# Altium schematic sheet 03a_POWER-DISCRETE.SchDoc
size A2
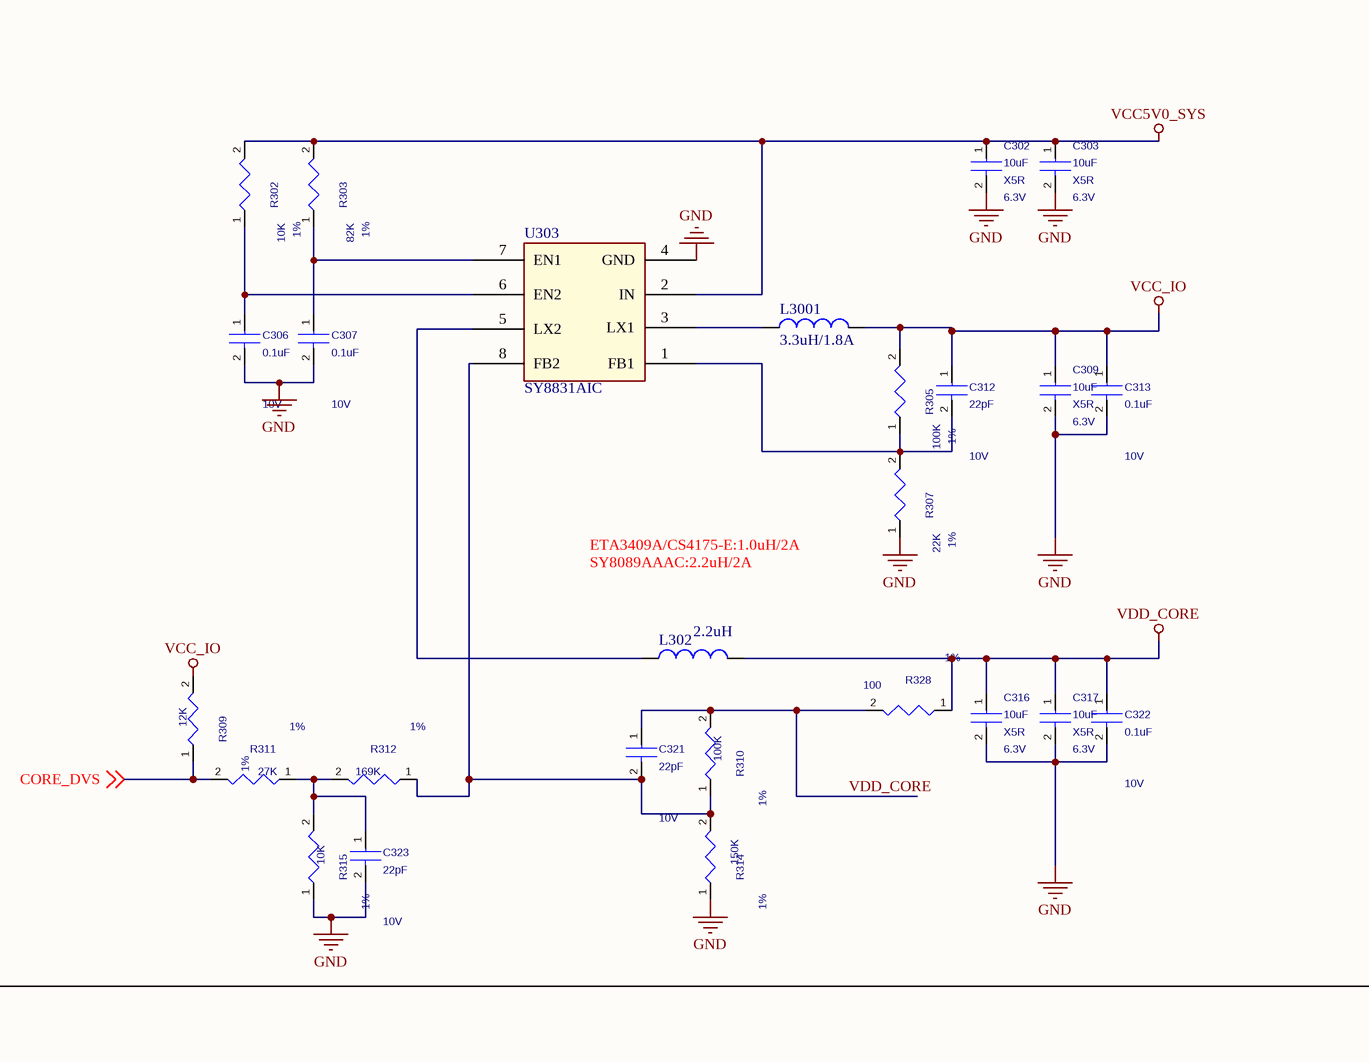
[diagram p0: 03a_POWER-DISCRETE.SchDoc, top left]
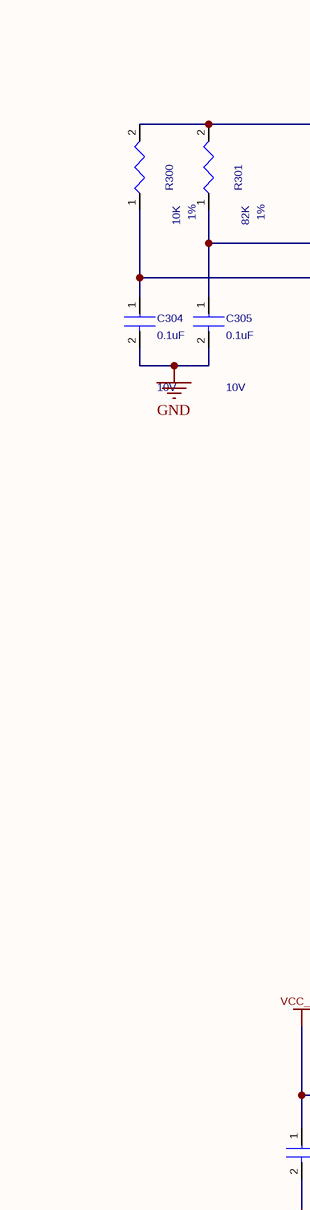
[diagram p1: 03a_POWER-DISCRETE.SchDoc, top middle]
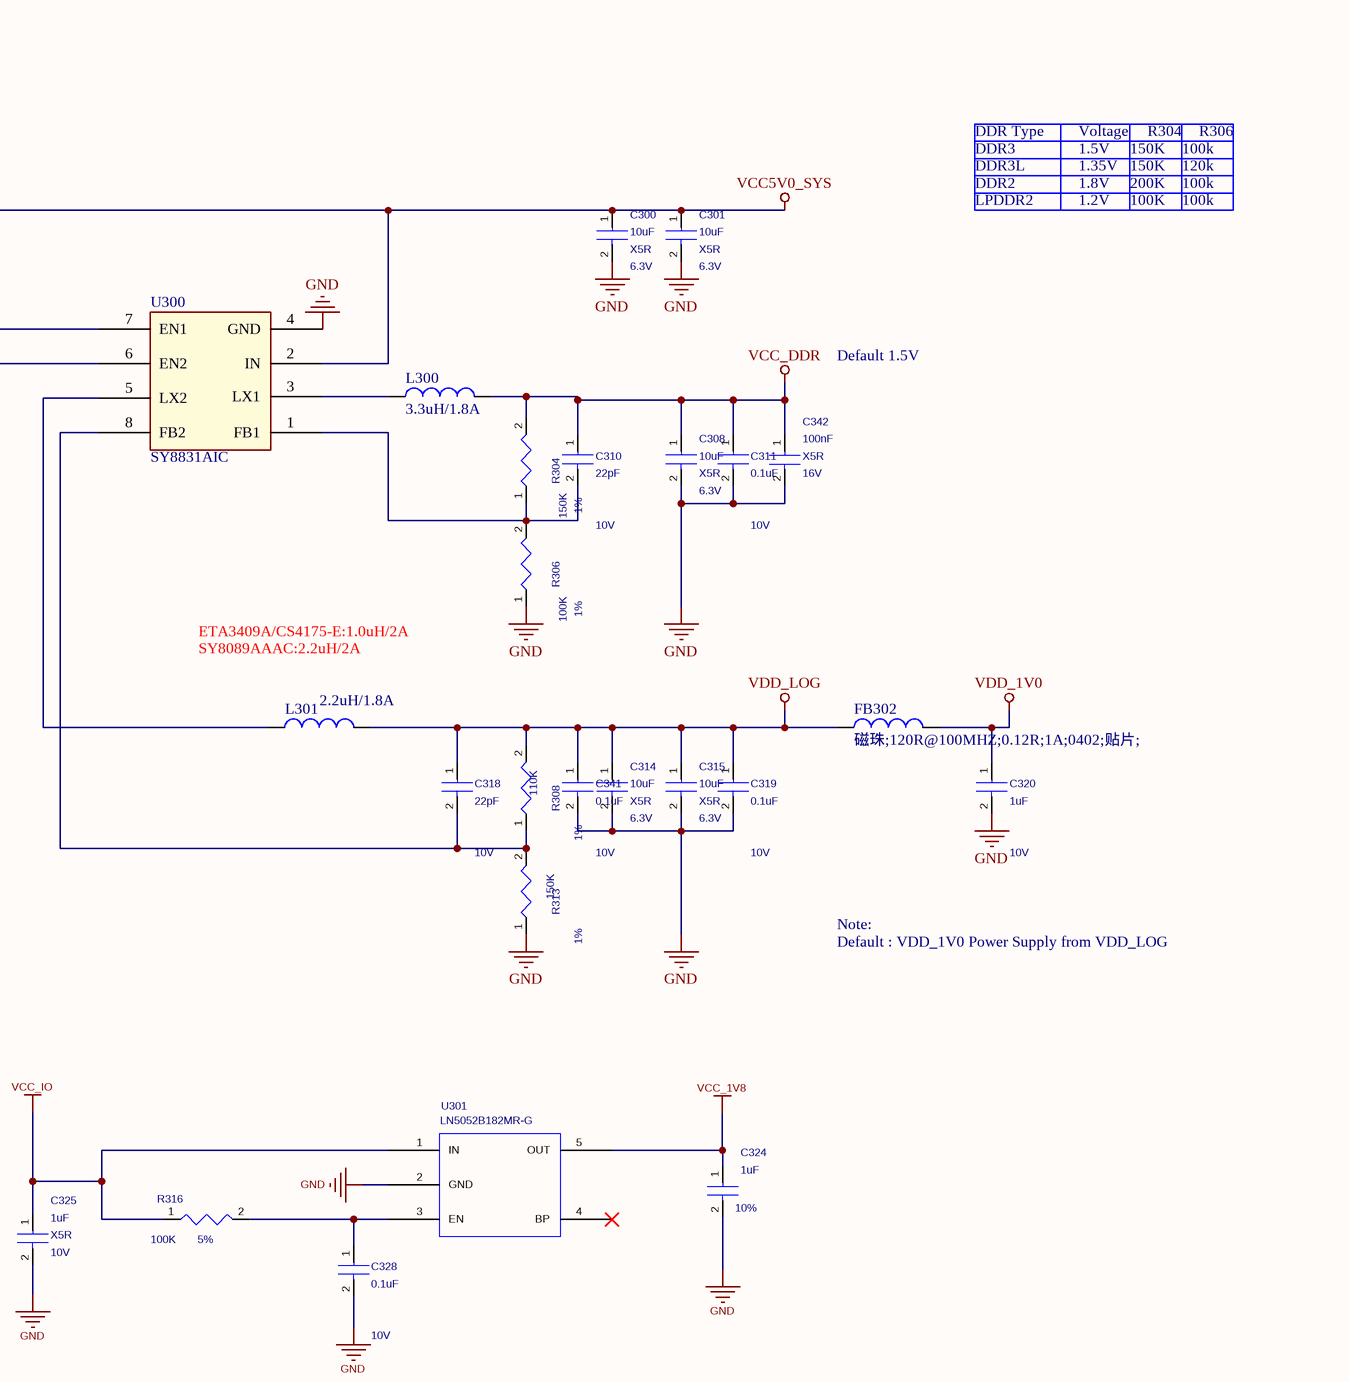
[diagram p2: 03a_POWER-DISCRETE.SchDoc, top right]
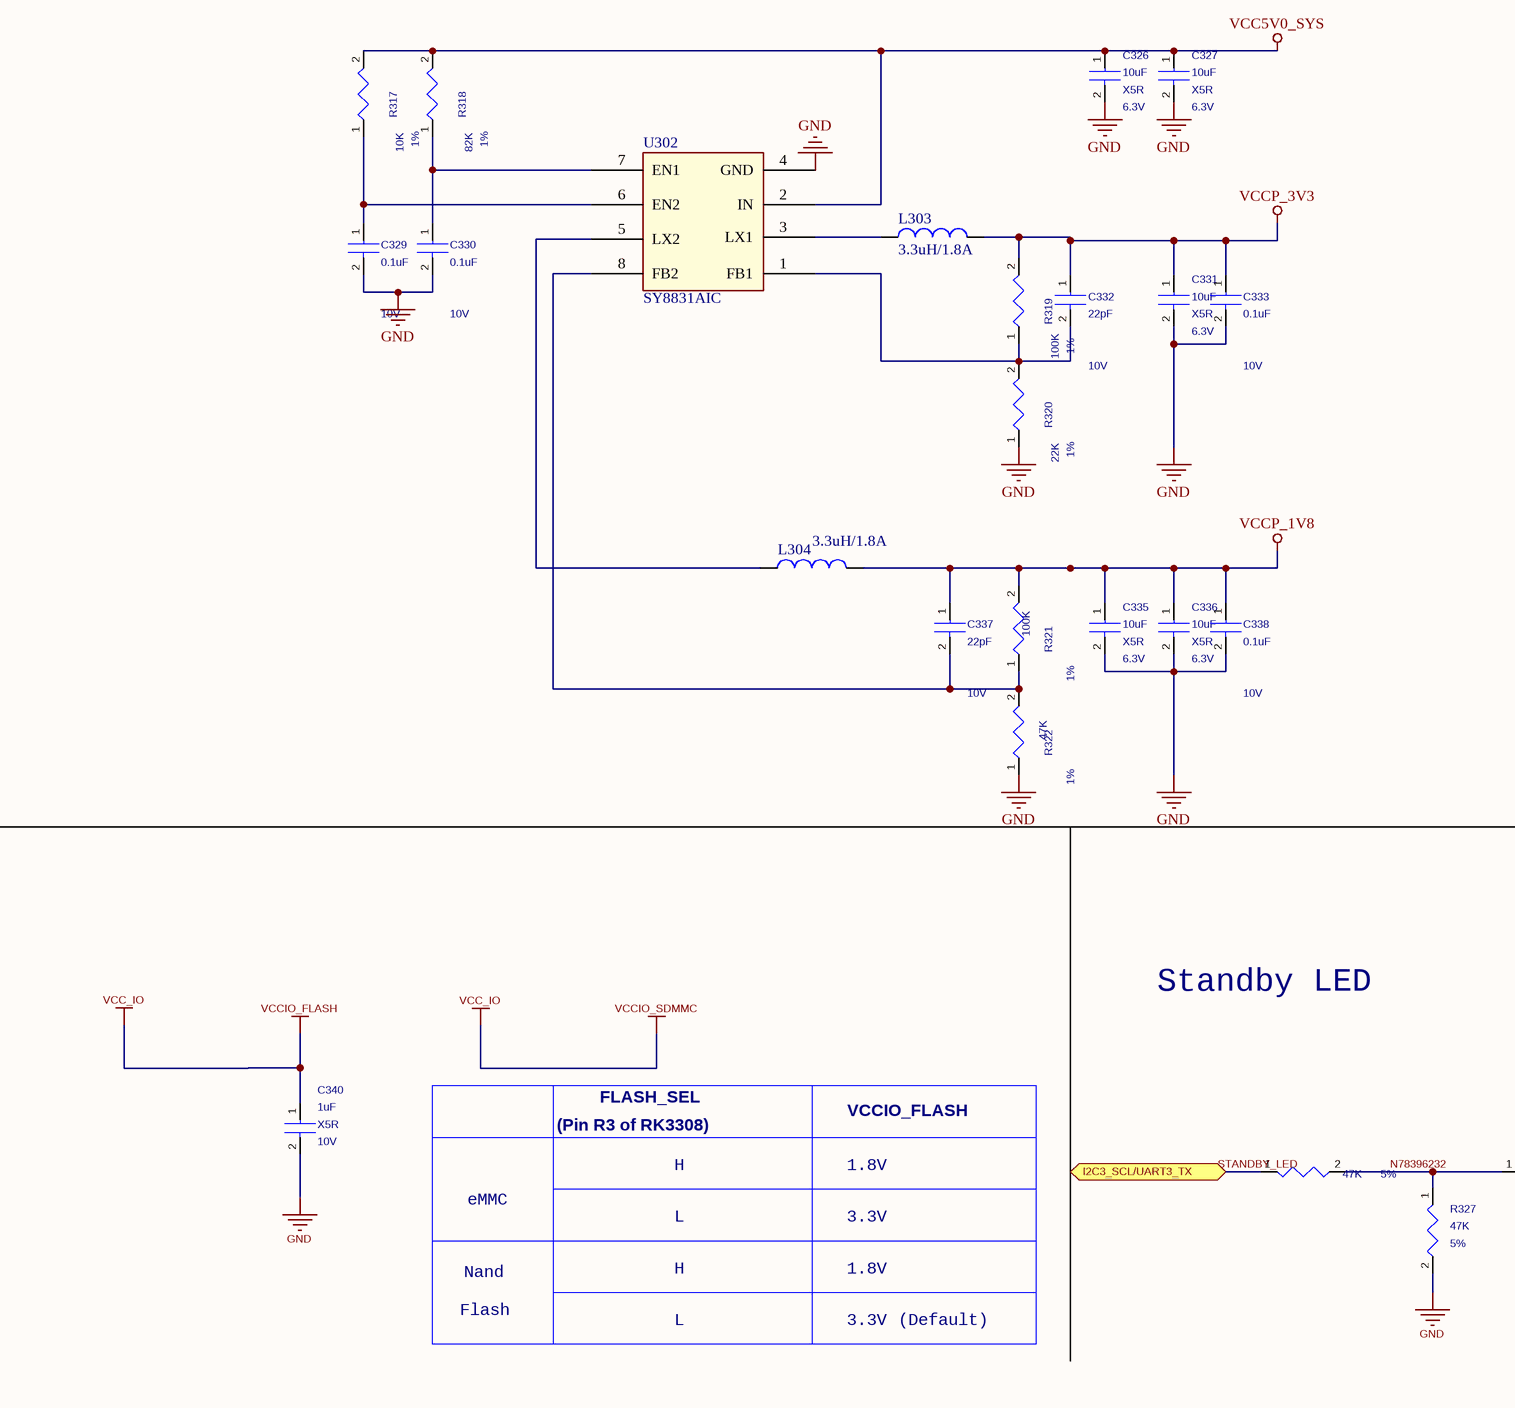
[diagram p3: 03a_POWER-DISCRETE.SchDoc, bottom left]
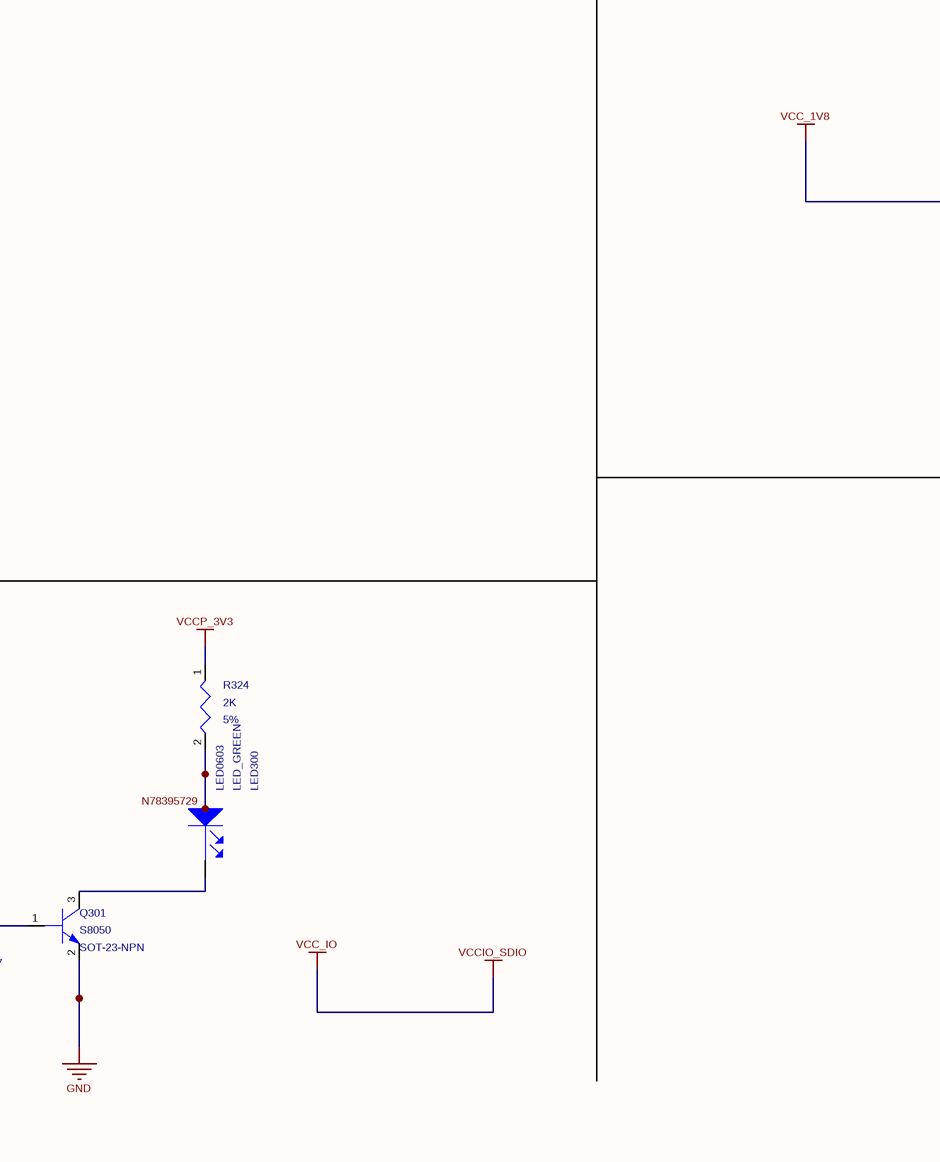
[diagram p4: 03a_POWER-DISCRETE.SchDoc, bottom middle]
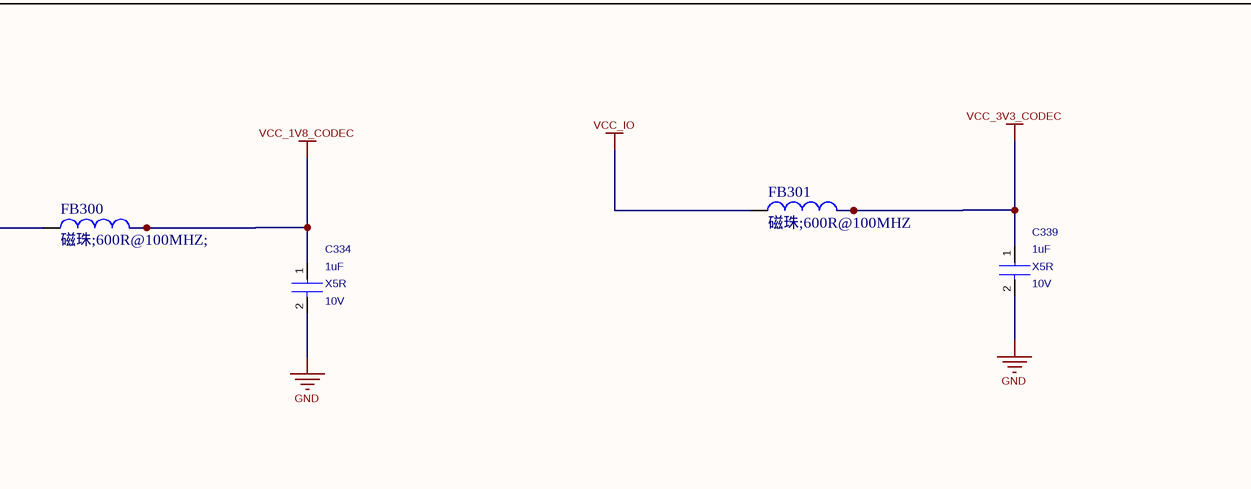
[diagram p5: 03a_POWER-DISCRETE.SchDoc, bottom right]

## Parts
C300  value 10uF  Dielectric: X5R  Voltage: 6.3V  [C0603]  (hidden comment: CAP_NP_2)
C301  value 10uF  Dielectric: X5R  Voltage: 6.3V  [C0603]  (hidden comment: CAP_NP_2)
C302  value 10uF  Dielectric: X5R  Voltage: 6.3V  [C0603]  (hidden comment: CAP_NP_2)
C303  value 10uF  Dielectric: X5R  Voltage: 6.3V  [C0603]  (hidden comment: CAP_NP_2)
C304  value 0.1uF  Voltage: 10V  [C0402]  (hidden comment: CAP_NP_2)
C305  value 0.1uF  Voltage: 10V  [C0402]  (hidden comment: CAP_NP_2)
C306  value 0.1uF  Voltage: 10V  [C0402]  (hidden comment: CAP_NP_2)
C307  value 0.1uF  Voltage: 10V  [C0402]  (hidden comment: CAP_NP_2)
C308  value 10uF  Dielectric: X5R  Voltage: 6.3V  [C0603]  (hidden comment: CAP_NP_2)
C309  value 10uF  Dielectric: X5R  Voltage: 6.3V  [C0603]  (hidden comment: CAP_NP_2)
C310  value 22pF  Voltage: 10V  [C0402]  (hidden comment: CAP_NP_2)
C311  value 0.1uF  Voltage: 10V  [C0402]  (hidden comment: CAP_NP_2)
C312  value 22pF  Voltage: 10V  [C0402]  (hidden comment: CAP_NP_2)
C313  value 0.1uF  Voltage: 10V  [C0402]  (hidden comment: CAP_NP_2)
C314  value 10uF  Dielectric: X5R  Voltage: 6.3V  [C0603]  (hidden comment: CAP_NP_2)
C315  value 10uF  Dielectric: X5R  Voltage: 6.3V  [C0603]  (hidden comment: CAP_NP_2)
C316  value 10uF  Dielectric: X5R  Voltage: 6.3V  [C0603]  (hidden comment: CAP_NP_2)
C317  value 10uF  Dielectric: X5R  Voltage: 6.3V  [C0603]  (hidden comment: CAP_NP_2)
C318  value 22pF  Voltage: 10V  [C0402]  (hidden comment: CAP_NP_2)
C319  value 0.1uF  Voltage: 10V  [C0402]  (hidden comment: CAP_NP_2)
C320  value 1uF  Voltage: 10V  [C0402]  (hidden comment: CAP_NP_2)
C321  value 22pF  Voltage: 10V  [C0402]  (hidden comment: CAP_NP_2)
C322  value 0.1uF  Voltage: 10V  [C0402]  (hidden comment: CAP_NP_2)
C323  value 22pF  Voltage: 10V  [C0402]  (hidden comment: CAP_NP_2)
C324  value 1uF  Tolerance: 10%  [C0402]  (hidden comment: CAP_NP_2)
C325  value 1uF  Voltage: 10V  Dielectric: X5R  [C0402]  (hidden comment: CAP_NP_2)
C326  value 10uF  Dielectric: X5R  Voltage: 6.3V  [C0603]  (hidden comment: CAP_NP_2)
C327  value 10uF  Dielectric: X5R  Voltage: 6.3V  [C0603]  (hidden comment: CAP_NP_2)
C328  value 0.1uF  Voltage: 10V  [C0402]  (hidden comment: CAP_NP_2)
C329  value 0.1uF  Voltage: 10V  [C0402]  (hidden comment: CAP_NP_2)
C330  value 0.1uF  Voltage: 10V  [C0402]  (hidden comment: CAP_NP_2)
C331  value 10uF  Dielectric: X5R  Voltage: 6.3V  [C0603]  (hidden comment: CAP_NP_2)
C332  value 22pF  Voltage: 10V  [C0402]  (hidden comment: CAP_NP_2)
C333  value 0.1uF  Voltage: 10V  [C0402]  (hidden comment: CAP_NP_2)
C334  value 1uF  Voltage: 10V  Dielectric: X5R  [C0402]  (hidden comment: CAP_NP_2)
C335  value 10uF  Dielectric: X5R  Voltage: 6.3V  [C0603]  (hidden comment: CAP_NP_2)
C336  value 10uF  Dielectric: X5R  Voltage: 6.3V  [C0603]  (hidden comment: CAP_NP_2)
C337  value 22pF  Voltage: 10V  [C0402]  (hidden comment: CAP_NP_2)
C338  value 0.1uF  Voltage: 10V  [C0402]  (hidden comment: CAP_NP_2)
C339  value 1uF  Voltage: 10V  Dielectric: X5R  [C0402]  (hidden comment: CAP_NP_2)
C340  value 1uF  Voltage: 10V  Dielectric: X5R  [C0402]  (hidden comment: CAP_NP_2)
C341  value 0.1uF  Voltage: 10V  [C0402]  (hidden comment: CAP_NP_2)
C342  value 100nF  Voltage: 16V  Dielectric: X5R  [C0402]  (hidden comment: CAP_NP_2)
FB300  磁珠;600R@100MHZ;  [L0402]
FB301  磁珠;600R@100MHZ  [L0402]
FB302  磁珠;120R@100MHZ;0.12R;1A;0402;贴片;  [L0402]
L300  3.3uH/1.8A  [IND2520]
L301  2.2uH/1.8A  [IND2520]
L302  2.2uH  [IND2520]
L303  3.3uH/1.8A  [IND2520]
L304  3.3uH/1.8A  [IND2520]
L3001  3.3uH/1.8A  [IND2520]
LED300  value LED_GREEN  [LED0603]  (hidden comment: LED)
Q301  value S8050  PCB DECAL: SOT-23-NPN  [SOT23]  (hidden comment: NPN)
R300  value 10K  Tolerance: 1%  [R0402]  (hidden comment: RESISTOR)
R301  value 82K  Tolerance: 1%  [R0402]  (hidden comment: RESISTOR)
R302  value 10K  Tolerance: 1%  [R0402]  (hidden comment: RESISTOR)
R303  value 82K  Tolerance: 1%  [R0402]  (hidden comment: RESISTOR)
R304  value 150K  Tolerance: 1%  [R0402]  (hidden comment: RESISTOR)
R305  value 100K  Tolerance: 1%  [R0402]  (hidden comment: RESISTOR)
R306  value 100K  Tolerance: 1%  [R0402]  (hidden comment: RESISTOR)
R307  value 22K  Tolerance: 1%  [R0402]  (hidden comment: RESISTOR)
R308  value 110K  Tolerance: 1%  [R0402]  (hidden comment: RESISTOR)
R309  value 12K  Tolerance: 1%  [R0402]  (hidden comment: RESISTOR)
R310  value 100K  Tolerance: 1%  [R0402]  (hidden comment: RESISTOR)
R311  value 27K  Tolerance: 1%  [R0402]  (hidden comment: RESISTOR)
R312  value 169K  Tolerance: 1%  [R0402]  (hidden comment: RESISTOR)
R313  value 150K  Tolerance: 1%  [R0402]  (hidden comment: RESISTOR)
R314  value 150K  Tolerance: 1%  [R0402]  (hidden comment: RESISTOR)
R315  value 10K  Tolerance: 1%  [R0402]  (hidden comment: RESISTOR)
R316  value 100K  Tolerance: 5%  [R0402]  (hidden comment: RESISTOR)
R317  value 10K  Tolerance: 1%  [R0402]  (hidden comment: RESISTOR)
R318  value 82K  Tolerance: 1%  [R0402]  (hidden comment: RESISTOR)
R319  value 100K  Tolerance: 1%  [R0402]  (hidden comment: RESISTOR)
R320  value 22K  Tolerance: 1%  [R0402]  (hidden comment: RESISTOR)
R321  value 100K  Tolerance: 1%  [R0402]  (hidden comment: RESISTOR)
R322  value 47K  Tolerance: 1%  [R0402]  (hidden comment: RESISTOR)
R324  value 2K  Tolerance: 5%  [R0402]  (hidden comment: RESISTOR)
R326  value 47K  Tolerance: 5%  [R0402]  (hidden comment: RESISTOR)
R327  value 47K  Tolerance: 5%  [R0402]  (hidden comment: RESISTOR)
R328  value 100  Tolerance: 1%  [R0402]  (hidden comment: RESISTOR)
U300  SY8831AIC  [TSOT23-8]
U301  LN5052B182MR-G  [SOT_23_5]
U302  SY8831AIC  [TSOT23-8]
U303  SY8831AIC  [TSOT23-8]

## Ports
I2C3_SCL/UART3_TX (bidir)

## Nets
GND: C300.2 C301.2 C302.2 C303.2 C304.2 C305.2 C306.2 C307.2 C308.2 C309.2 C311.2 C313.2 C314.2 C315.2 C316.2 C317.2 C319.2 C320.2 C322.2 C323.2 C324.2 C325.2 C326.2 C327.2 C328.2 C329.2 C330.2 C331.2 C333.2 C334.2 C335.2 C336.2 C338.2 C339.2 C340.2 C341.2 C342.2 Q301.2(EMITTER) R306.1 R307.1 R313.1 R314.1 R315.1 R320.1 R322.1 R327.2 U300.4(GND) U301.2(GND) U302.4(GND) U303.4(GND)
VCC5V0_SYS: C300.1 C301.1 C302.1 C303.1 C326.1 C327.1 R300.2 R301.2 R302.2 R303.2 R317.2 R318.2 U300.2(IN) U302.2(IN) U303.2(IN)
VCC_1V8: C324.1 FB300.1 U301.5(OUT)
VCC_1V8_CODEC: C334.1 FB300.2
VCC_3V3_CODEC: C339.1 FB301.2
VCC_DDR: C308.1 C310.1 C311.1 C342.1 L300.2 R304.2
VCC_IO: C309.1 C312.1 C313.1 C325.1 C340.1 FB301.1 L3001.2 R305.2 R309.2 R316.1 U301.1(IN)  [also labelled VCCIO_FLASH, VCCIO_SDIO, VCCIO_SDMMC]
VCCP_1V8: C335.1 C336.1 C337.1 C338.1 L304.2 R321.2
VCCP_3V3: C331.1 C332.1 C333.1 L303.2 R319.2 R324.1
VDD_1V0: C320.1 FB302.2
VDD_CORE: C316.1 C317.1 C321.1 C322.1 L302.2 R310.2 R328.1 R328.2
VDD_LOG: C314.1 C315.1 C318.1 C319.1 C341.1 FB302.1 L301.2 R308.2
CORE_DVS: R309.1 R311.2 ; off-sheet CORE_DVS
I2C3_SCL/UART3_TX: R326.1 ; port I2C3_SCL/UART3_TX
N78396232: Q301.1(BASE) R326.2 R327.1
NetC304_1: C304.1 R300.1 U300.6(EN2)
NetC305_1: C305.1 R301.1 U300.7(EN1)
NetC306_1: C306.1 R302.1 U303.6(EN2)
NetC307_1: C307.1 R303.1 U303.7(EN1)
NetC310_2: C310.2 R304.1 R306.2 U300.1(FB1)
NetC312_2: C312.2 R305.1 R307.2 U303.1(FB1)
NetC318_2: C318.2 R308.1 R313.2 U300.8(FB2)
NetC321_2: C321.2 R310.1 R312.1 R314.2 U303.8(FB2)
NetC323_1: C323.1 R311.1 R312.2 R315.2
NetC328_1: C328.1 R316.2 U301.3(EN)
NetC329_1: C329.1 R317.1 U302.6(EN2)
NetC330_1: C330.1 R318.1 U302.7(EN1)
NetC332_2: C332.2 R319.1 R320.2 U302.1(FB1)
NetC337_2: C337.2 R321.1 R322.2 U302.8(FB2)
NetL300_1: L300.1 U300.3(LX1)
NetL301_1: L301.1 U300.5(LX2)
NetL302_1: L302.1 U303.5(LX2)
NetL303_1: L303.1 U302.3(LX1)
NetL304_1: L304.1 U302.5(LX2)
NetL3001_1: L3001.1 U303.3(LX1)
NetLED300_1: LED300.1(ANODE) R324.2
NetLED300_2: LED300.2(CATHODE) Q301.3(COLLECTOR)

Not connected (* = marked no-connect by the designer): U301 4(BP)*

## Notes on the sheet
- DDR Type
- DDR3
- DDR3L
- DDR2
- LPDDR2
- Voltage
- 1.5V
- 1.35V
- 1.8V
- 1.2V
- 150K
- 200K
- 100K
- R304
- 100k
- 120k
- R306
- Default 1.5V
- ETA3409A/CS4175-E:1.0uH/2A
- SY8089AAAC:2.2uH/2A
- Note:
- Default : VDD_1V0 Power Supply from VDD_LOG
- Standby LED
- FLASH_SEL
- (Pin R3 of RK3308)
- H
- VCCIO_FLASH
- Nand
- eMMC
- L
- 3.3V
- Flash
- (Default)
- Labels drawn without touching a wire or pin: N78395729, STANDBY_LED
- Title
- Size:
- Date:
- File:
- A2
- Number:
- Time:
- Revision:
- Sheet
- of

## Library data of the parts
C300-C303 C308 C309 C314-C317 C326 C327 C331 C335 C336 = CAP_NP_2: cap,10.00uF,+/-10%,6.3V,X5R,C0603; Manufacturer: TDK; RK_PN: C1608X5R0J106K080AB; Priority: A; Tolerance: 10%; Created_by: JJJ; Source_Path: Z:\RK_STANDARD_LIBRARY\CADENCE_CIS\RK_DISCRETE.OLB; Number: 1; PCB DECAL: C0603; Part_Type: C0603; Manufacturer_PN: C1608X5R0J106K080AB
C304-C307 C311 C313 C319 C322 C328-C330 C333 C338 C341 = CAP_NP_2: cap,0.1uF,+/-10%,10V,X5R,C0402; Manufacturer: TDK; RK_PN: C1005X5R1A105K050BB; Priority: A; C_Voltage: 6.3V; Tolerance: 10%; Created_by: JJJ; Source_Path: Z:\RK_STANDARD_LIBRARY\CADENCE_CIS\RK_DISCRETE.OLB; Part_Type: C0402; Dielectric: X5R; Manufacturer_PN: C1005X5R1A105K050BB; PCB DECAL: C0402
C310 C312 C318 C321 C323 C332 C337 = CAP_NP_2: cap,22pF,+/-10%,10V,X5R,C0402; Manufacturer: TDK; RK_PN: C1005X5R1A105K050BB; Priority: A; C_Voltage: 6.3V; Tolerance: 10%; Created_by: JJJ; Source_Path: Z:\RK_STANDARD_LIBRARY\CADENCE_CIS\RK_DISCRETE.OLB; Part_Type: C0402; Dielectric: X5R; Manufacturer_PN: C1005X5R1A105K050BB; PCB DECAL: C0402
C320 = CAP_NP_2: cap,1uF,+/-10%,10V,X5R,C0402; Manufacturer: TDK; RK_PN: C1005X5R1A105K050BB; Priority: A; C_Voltage: 6.3V; Tolerance: 10%; Created_by: JJJ; Source_Path: Z:\RK_STANDARD_LIBRARY\CADENCE_CIS\RK_DISCRETE.OLB; Part_Type: C0402; Dielectric: X5R; Manufacturer_PN: C1005X5R1A105K050BB; PCB DECAL: C0402
C324 = CAP_NP_2: cap,1.00uF,+/-10%,10V,X5R,C0402; Manufacturer_PN: C1005X5R1A105K050BB; Manufacturer: TDK; Created_by: JJJ; C_Voltage: 6.3V; Priority: A; Source_Path: Z:\RK_STANDARD_LIBRARY\CADENCE_CIS\RK_DISCRETE.OLB; PCB DECAL: C0402; Voltage: 10V; Dielectric: X5R; Part_Type: C0402; RK_PN: C1005X5R1A105K050BB
C325 = CAP_NP_2: cap,1.00uF,+/-10%,10V,X5R,C0402; Manufacturer: TDK; RK_PN: C1005X5R1A105K050BB; Priority: A; C_Voltage: 6.3V; Tolerance: 10%; Created_by: JJJ; Source_Path: Z:\RK_STANDARD_LIBRARY\CADENCE_CIS\RK_DISCRETE.OLB; PCB DECAL: C0402; Part_Type: C0402; Manufacturer_PN: C1005X5R1A105K050BB
C334 C339 C340 = CAP_NP_2: cap,1.00uF,+/-10%,10V,X5R,C0402; Manufacturer_PN: C1005X5R1A105K050BB; Manufacturer: TDK; Created_by: JJJ; Tolerance: 10%; C_Voltage: 6.3V; Priority: A; Source_Path: Z:\RK_STANDARD_LIBRARY\CADENCE_CIS\RK_DISCRETE.OLB; PCB DECAL: C0402; Part_Type: C0402; RK_PN: C1005X5R1A105K050BB
C342 = CAP_NP_2: cap,100.00nF,+/-10%,16V,X5R,C0402; Manufacturer: TDK; Number: 1; RK_PN: C1005X5R1C104K050BA; Priority: A; Tolerance: 10%; Created_by: JJJ; Source_Path: Z:\RK_STANDARD_LIBRARY\CADENCE_CIS\RK_DISCRETE.OLB; PCB DECAL: C0402; Part_Type: C0402; Manufacturer_PN: C1005X5R1C104K050BA
FB300 = INDUCTOR: GZ0603D601TF
FB301 = INDUCTOR: L0603-0欧姆-1A
FB302 = INDUCTOR: PZ1005U121-1R0T
L300 L303 L304 L3001 = INDUCTOR: SWPA252012S3R3MT
L301 L302 = INDUCTOR: SPH252012H2R2MT
LED300 = LED: 贴片LED灯，0603，绿色; Created_by: JJJ; Priority: A; Source_Path: Z:\RK_STANDARD_LIBRARY\CADENCE_CIS\RK_DISCRETE.OLB; PCB DECAL: LED0603; Part_Type: LED; RK_PN: LED_GREEN
Q301 = NPN: S8050,SOT23; Manufacturer_PN: S8050_SOT23; Manufacturer: 长电; Created_by: JJJ; Pc: 0.3W; Vceo: 25V; Ic: 0.5A; Priority: A; Source_Path: Z:\RK_STANDARD_LIBRARY\CADENCE_CIS\RK_DISCRETE.OLB; Number: 1; Geometry.Height: 1.100mm; Part_Type: NPN; RK_PN: S8050
R300 R302 R315 R317 = RESISTOR: ?用厚膜电阻,10K,+/-1%,R0402,1/16W.; Manufacturer_PN: RC0402FR-0727KL; Manufacturer: YAGEO; Created_by: YTL; Wattage: 1/16W; Priority: A; Source_Path: Z:\RK_STANDARD_LIBRARY\CADENCE_CIS\RK_DISCRETE.OLB; PCB DECAL: R0402; Part_Type: ?用厚膜电阻; RK_PN: RC0402FR-0727KL
R301 R303 R318 = RESISTOR: ?用厚膜电阻,82K,+/-1%,R0402,1/16W.; Manufacturer_PN: RC0402FR-0727KL; Manufacturer: YAGEO; Created_by: YTL; Wattage: 1/16W; Priority: A; Source_Path: Z:\RK_STANDARD_LIBRARY\CADENCE_CIS\RK_DISCRETE.OLB; PCB DECAL: R0402; Part_Type: ?用厚膜电阻; RK_PN: RC0402FR-0727KL
R304 R313 R314 = RESISTOR: ?用厚膜电阻,150K,+/-1%,R0402,1/16W.; Manufacturer_PN: RC0402FR-0727KL; Manufacturer: YAGEO; Created_by: YTL; Wattage: 1/16W; Priority: A; Source_Path: Z:\RK_STANDARD_LIBRARY\CADENCE_CIS\RK_DISCRETE.OLB; PCB DECAL: R0402; Part_Type: ?用厚膜电阻; RK_PN: RC0402FR-0727KL
R305 R306 R310 R319 R321 = RESISTOR: ?用厚膜电阻,100K,+/-1%,R0402,1/16W.; Manufacturer_PN: RC0402FR-0727KL; Manufacturer: YAGEO; Created_by: YTL; Wattage: 1/16W; Priority: A; Source_Path: Z:\RK_STANDARD_LIBRARY\CADENCE_CIS\RK_DISCRETE.OLB; PCB DECAL: R0402; Part_Type: ?用厚膜电阻; RK_PN: RC0402FR-0727KL
R307 R320 = RESISTOR: ?用厚膜电阻,22K,+/-1%,R0402,1/16W.; Manufacturer_PN: RC0402FR-0727KL; Manufacturer: YAGEO; Created_by: YTL; Wattage: 1/16W; Priority: A; Source_Path: Z:\RK_STANDARD_LIBRARY\CADENCE_CIS\RK_DISCRETE.OLB; PCB DECAL: R0402; Part_Type: ?用厚膜电阻; RK_PN: RC0402FR-0727KL
R308 = RESISTOR: ?用厚膜电阻,110K,+/-1%,R0402,1/16W.; Manufacturer_PN: RC0402FR-0727KL; Manufacturer: YAGEO; Created_by: YTL; Wattage: 1/16W; Priority: A; Source_Path: Z:\RK_STANDARD_LIBRARY\CADENCE_CIS\RK_DISCRETE.OLB; PCB DECAL: R0402; Part_Type: ?用厚膜电阻; RK_PN: RC0402FR-0727KL
R309 = RESISTOR: ?用厚膜电阻,12K,+/-1%,R0402,1/16W.; Manufacturer_PN: RC0402FR-0727KL; Manufacturer: YAGEO; Created_by: YTL; Wattage: 1/16W; Priority: A; Source_Path: Z:\RK_STANDARD_LIBRARY\CADENCE_CIS\RK_DISCRETE.OLB; PCB DECAL: R0402; Part_Type: ?用厚膜电阻; RK_PN: RC0402FR-0727KL
R311 = RESISTOR: ?用厚膜电阻,27K,+/-1%,R0402,1/16W.; Manufacturer_PN: RC0402FR-0727KL; Manufacturer: YAGEO; Created_by: YTL; Wattage: 1/16W; Priority: A; Source_Path: Z:\RK_STANDARD_LIBRARY\CADENCE_CIS\RK_DISCRETE.OLB; PCB DECAL: R0402; Part_Type: ?用厚膜电阻; RK_PN: RC0402FR-0727KL
R312 = RESISTOR: ?用厚膜电阻,169K,+/-1%,R0402,1/16W.; Manufacturer_PN: RC0402FR-0727KL; Manufacturer: YAGEO; Created_by: YTL; Wattage: 1/16W; Priority: A; Source_Path: Z:\RK_STANDARD_LIBRARY\CADENCE_CIS\RK_DISCRETE.OLB; PCB DECAL: R0402; Part_Type: ?用厚膜电阻; RK_PN: RC0402FR-0727KL
R316 = RESISTOR: ?用厚膜电阻,100K,+/-5%,R0402,1/16W.; Manufacturer: YAGEO; RK_PN: RC0402JR-07100KL; Priority: A; Wattage: 1/16W; Created_by: YTL; Source_Path: Z:\RK_STANDARD_LIBRARY\CADENCE_CIS\RK_DISCRETE.OLB; Number: 1; PCB DECAL: R0402; Part_Type: ?用厚膜电阻; Manufacturer_PN: RC0402JR-07100KL
R322 = RESISTOR: ?用厚膜电阻,47K,+/-1%,R0402,1/16W.; Manufacturer_PN: RC0402FR-0727KL; Manufacturer: YAGEO; Created_by: YTL; Wattage: 1/16W; Priority: A; Source_Path: Z:\RK_STANDARD_LIBRARY\CADENCE_CIS\RK_DISCRETE.OLB; PCB DECAL: R0402; Part_Type: ?用厚膜电阻; RK_PN: RC0402FR-0727KL
R324 = RESISTOR: ?用厚膜电阻,2K,+/-5%,R0402,1/16W.; Manufacturer: YAGEO; RK_PN: RC0402JR-072KL; Priority: A; Wattage: 1/16W; Created_by: YTL; Source_Path: Z:\RK_STANDARD_LIBRARY\CADENCE_CIS\RK_DISCRETE.OLB; PCB DECAL: R0402; Part_Type: ?用厚膜电阻; Manufacturer_PN: RC0402JR-072KL
R326 = RESISTOR: ?用厚膜电阻,47K,+/-5%,R0402,1/16W.; Manufacturer_PN: RC0402JR-0747KL; Manufacturer: YAGEO; Created_by: YTL; Wattage: 1/16W; Priority: A; Source_Path: Z:\RK_STANDARD_LIBRARY\CADENCE_CIS\RK_DISCRETE.OLB; PCB DECAL: R0402; Part_Type: ?用厚膜电阻; RK_PN: RC0402JR-0747KL
R327 = RESISTOR: ?用厚膜电阻,47K,+/-5%,R0402,1/16W.; Manufacturer: YAGEO; RK_PN: RC0402JR-0747KL; Priority: A; Wattage: 1/16W; Created_by: YTL; Source_Path: Z:\RK_STANDARD_LIBRARY\CADENCE_CIS\RK_DISCRETE.OLB; PCB DECAL: R0402; Part_Type: ?用厚膜电阻; Manufacturer_PN: RC0402JR-0747KL
R328 = RESISTOR: ?用厚膜电阻,100,+/-1%,R0402,1/16W.; Manufacturer_PN: RC0402FR-0727KL; Manufacturer: YAGEO; Created_by: YTL; Wattage: 1/16W; Priority: A; Source_Path: Z:\RK_STANDARD_LIBRARY\CADENCE_CIS\RK_DISCRETE.OLB; PCB DECAL: R0402; Part_Type: ?用厚膜电阻; RK_PN: RC0402FR-0727KL
U300 U302 U303 = SY8831: SY8831AICSOT23-8
U301 = LDO_PT5108: High-PSRR 600mA LDO.Output1.8V.; Part_Type: LDO; Manufacturer: Powtech(华润矽威）; RK_PN: ME6212C18M5G; Priority: A; Created_by: JJJ; Source_Path: Z:\RK_STANDARD_LIBRARY\CADENCE_CIS\RK_IC.OLB; Number: 1; PCB DECAL: SOT_23_5; Manufacturer_PN: LN5052B182MR-G; Value: LN5052B182MR-G